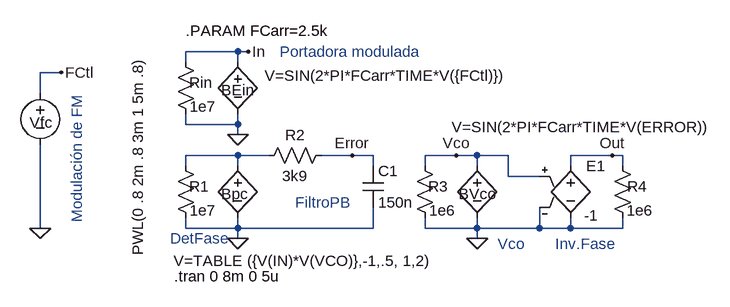
[diagram p0: schematic Pll_Ana.asc]
Pll_Ana.asc, the LTspice schematic file:
Version 4
SHEET 1 892 692
WIRE -528 256 -528 224
WIRE -528 464 -528 336
WIRE -496 224 -528 224
WIRE -304 208 -304 192
WIRE -304 304 -304 288
WIRE -304 368 -304 352
WIRE -304 464 -304 448
WIRE -224 192 -304 192
WIRE -224 208 -224 192
WIRE -224 304 -304 304
WIRE -224 304 -224 288
WIRE -224 320 -224 304
WIRE -224 352 -304 352
WIRE -224 368 -224 352
WIRE -224 464 -304 464
WIRE -224 464 -224 448
WIRE -224 480 -224 464
WIRE -208 192 -224 192
WIRE -176 352 -224 352
WIRE -48 352 -96 352
WIRE -16 352 -48 352
WIRE -16 368 -16 352
WIRE -16 464 -224 464
WIRE -16 464 -16 432
WIRE 64 368 64 352
WIRE 64 464 64 448
WIRE 112 352 64 352
WIRE 144 352 112 352
WIRE 144 368 144 352
WIRE 144 464 64 464
WIRE 144 464 144 448
WIRE 144 480 144 464
WIRE 192 352 144 352
WIRE 192 384 192 352
WIRE 240 384 192 384
WIRE 240 464 144 464
WIRE 240 464 240 432
WIRE 288 368 288 352
WIRE 288 464 240 464
WIRE 288 464 288 448
WIRE 352 352 288 352
WIRE 368 352 352 352
WIRE 368 368 368 352
WIRE 368 464 288 464
WIRE 368 464 368 448
FLAG -224 320 0
FLAG -208 192 In
FLAG -224 480 0
FLAG -48 352 Error
FLAG 144 480 0
FLAG 352 352 Out
FLAG -528 464 0
FLAG -496 224 FCtl
FLAG 112 352 Vco
SYMBOL bv -224 192 R0
WINDOW 0 -26 59 Left 0
WINDOW 3 41 37 Left 0
SYMATTR InstName BEin
SYMATTR Value V=SIN(2*PI*FCarr*TIME*V({FCtl)})
SYMBOL res -320 192 R0
WINDOW 0 21 48 Left 0
WINDOW 3 22 85 Left 0
SYMATTR InstName Rin
SYMATTR Value 1e7
SYMBOL res -320 352 R0
WINDOW 0 21 48 Left 0
WINDOW 3 22 85 Left 0
SYMATTR InstName R1
SYMATTR Value 1e7
SYMBOL res -80 336 R90
WINDOW 0 0 56 VBottom 0
WINDOW 3 32 56 VTop 0
SYMATTR InstName R2
SYMATTR Value 3k9
SYMBOL cap -32 368 R0
SYMATTR InstName C1
SYMATTR Value 150n
SYMBOL bv 144 352 R0
WINDOW 0 -28 59 Left 0
WINDOW 3 -39 -44 Left 0
SYMATTR InstName BVco
SYMATTR Value V=SIN(2*PI*FCarr*TIME*V(ERROR))
SYMBOL res 48 352 R0
WINDOW 0 21 48 Left 0
WINDOW 3 22 85 Left 0
SYMATTR InstName R3
SYMATTR Value 1e6
SYMBOL e 288 352 R0
WINDOW 3 21 92 Left 0
SYMATTR Value -1
SYMATTR InstName E1
SYMBOL voltage -528 240 R0
WINDOW 0 -16 61 Left 0
WINDOW 3 150 -38 VRight 0
WINDOW 123 0 0 Left 0
WINDOW 39 24 132 Left 0
SYMATTR InstName Vfc
SYMATTR Value PWL(0 .8 2m .8 3m 1 5m .8)
SYMBOL bv -224 352 R0
WINDOW 0 -26 59 Left 0
WINDOW 3 -99 162 Left 0
SYMATTR InstName Bpc
SYMATTR Value V=TABLE ({V(IN)*V(VCO)},-1,.5, 1,2)
SYMBOL res 352 352 R0
WINDOW 0 23 48 Left 0
WINDOW 3 22 85 Left 0
SYMATTR InstName R4
SYMATTR Value 1e6
TEXT -304 160 Left 0 !.PARAM FCarr=2.5k
TEXT -322 538 Left 0 !.tran 0 8m 0 5u
TEXT 264 488 Left 0 ;Inv.Fase
TEXT -160 192 Left 0 ;Portadora modulada
TEXT -472 256 VRight 0 ;Modulación de FM
TEXT -328 480 Left 0 ;DetFase
TEXT -136 424 Left 0 ;FiltroPB
TEXT 176 488 Left 0 ;Vco

The netlist it stands for:
* Pll_Ana.asc
BEin In 0 V=SIN(2*PI*FCarr*TIME*V({FCtl)})
Rin In 0 1e7
R1 N001 0 1e7
R2 Error N001 3k9
C1 Error 0 150n
BVco Vco 0 V=SIN(2*PI*FCarr*TIME*V(ERROR))
R3 Vco 0 1e6
E1 Out 0 Vco 0 -1
Vfc FCtl 0 PWL(0 .8 2m .8 3m 1 5m .8)
Bpc N001 0 V=TABLE ({V(IN)*V(VCO)},-1,.5, 1,2)
R4 Out 0 1e6
.PARAM FCarr=2.5k
.tran 0 8m 0 5u
* Inv.Fase
* Portadora modulada
* Modulación de FM
* DetFase
* FiltroPB
* Vco
.backanno
.end